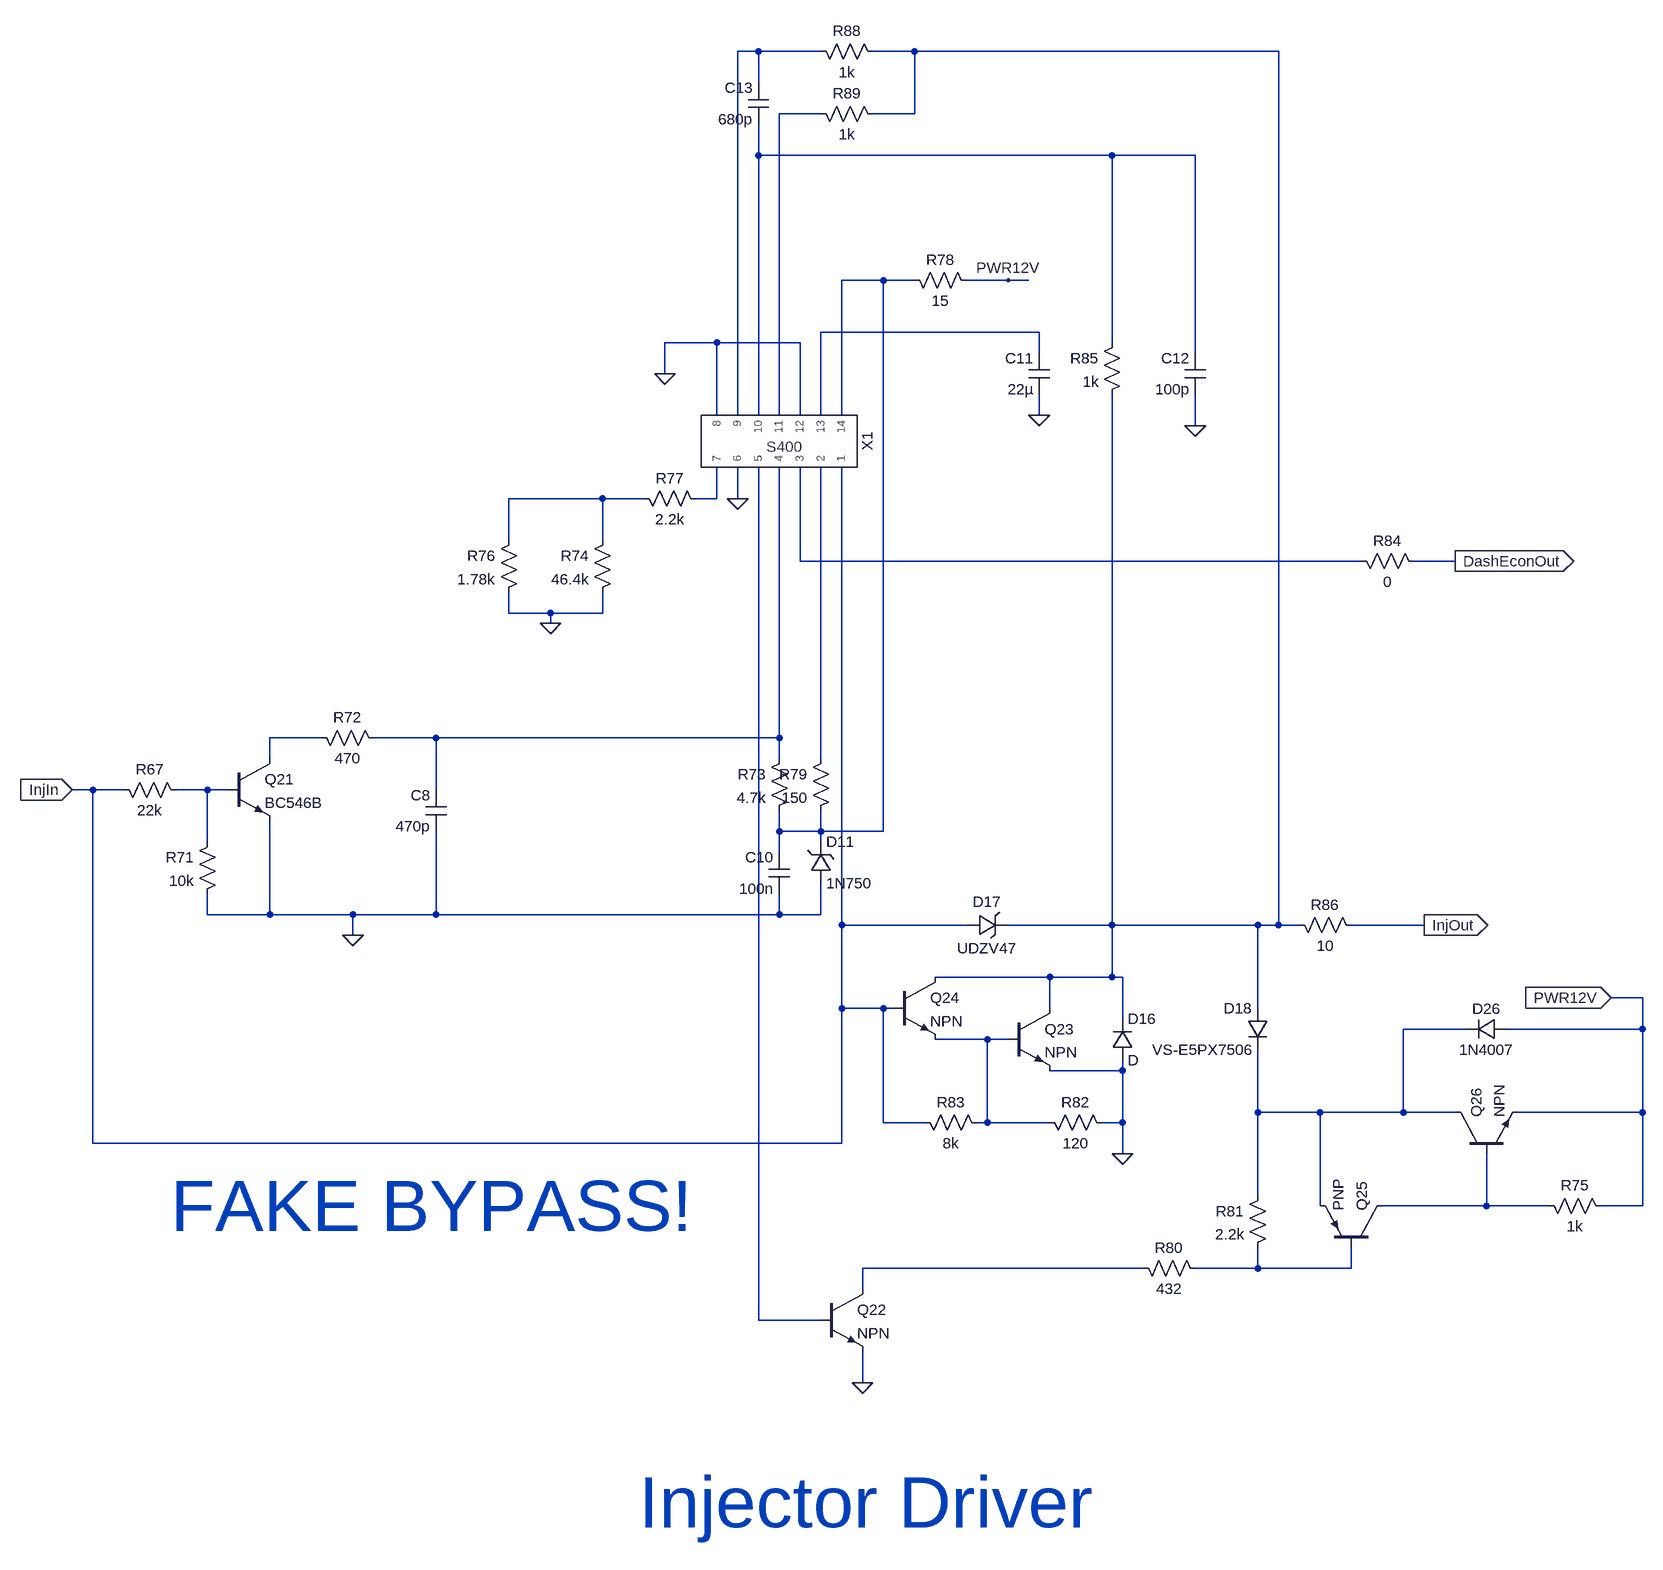
[diagram p0: schematic dme_analog_injector_driver.asc]
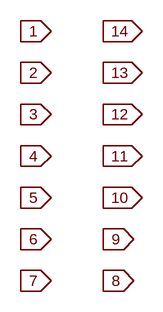
[diagram p1: sub-circuit s400.asc]
dme_analog_injector_driver.asc, the LTspice schematic file:
Version 4
SHEET 1 4356 3824
WIRE -2992 1072 -3024 1072
WIRE -2896 1072 -2992 1072
WIRE -2752 1072 -2816 1072
WIRE -2192 1072 -2752 1072
WIRE -2992 1120 -2992 1072
WIRE -2896 1168 -2960 1168
WIRE -2752 1168 -2752 1072
WIRE -2752 1168 -2816 1168
WIRE -2992 1232 -2992 1184
WIRE -2448 1232 -2992 1232
WIRE -2320 1232 -2448 1232
WIRE -2800 1424 -2864 1424
WIRE -2752 1424 -2800 1424
WIRE -2608 1424 -2672 1424
WIRE -2576 1424 -2608 1424
WIRE -2560 1504 -2896 1504
WIRE -3056 1520 -3136 1520
WIRE -2928 1520 -3056 1520
WIRE -2448 1520 -2448 1232
WIRE -2560 1536 -2560 1504
WIRE -2320 1536 -2320 1232
WIRE -3136 1568 -3136 1520
WIRE -3056 1632 -3056 1520
WIRE -3024 1632 -3024 1072
WIRE -2992 1632 -2992 1232
WIRE -2960 1632 -2960 1168
WIRE -2928 1632 -2928 1520
WIRE -2896 1632 -2896 1504
WIRE -2864 1632 -2864 1424
WIRE -2560 1632 -2560 1600
WIRE -2320 1648 -2320 1600
WIRE -3232 1760 -3376 1760
WIRE -3168 1760 -3232 1760
WIRE -3056 1760 -3056 1712
WIRE -3056 1760 -3088 1760
WIRE -3024 1760 -3024 1712
WIRE -3376 1824 -3376 1760
WIRE -3232 1824 -3232 1760
WIRE -2928 1856 -2928 1712
WIRE -2064 1856 -2928 1856
WIRE -1920 1856 -1984 1856
WIRE -3376 1936 -3376 1904
WIRE -3312 1936 -3376 1936
WIRE -3232 1936 -3232 1904
WIRE -3232 1936 -3312 1936
WIRE -3312 1952 -3312 1936
WIRE -3664 2128 -3744 2128
WIRE -3488 2128 -3584 2128
WIRE -2960 2128 -2960 1712
WIRE -2960 2128 -3488 2128
WIRE -3744 2160 -3744 2128
WIRE -2960 2160 -2960 2128
WIRE -2896 2160 -2896 1712
WIRE -4016 2208 -4048 2208
WIRE -3968 2208 -4016 2208
WIRE -3840 2208 -3888 2208
WIRE -3808 2208 -3840 2208
WIRE -3488 2208 -3488 2128
WIRE -2960 2272 -2960 2240
WIRE -2896 2272 -2896 2240
WIRE -2896 2272 -2960 2272
WIRE -2800 2272 -2800 1424
WIRE -2800 2272 -2896 2272
WIRE -3840 2288 -3840 2208
WIRE -2896 2288 -2896 2272
WIRE -2960 2304 -2960 2272
WIRE -3840 2400 -3840 2368
WIRE -3744 2400 -3744 2256
WIRE -3744 2400 -3840 2400
WIRE -3616 2400 -3744 2400
WIRE -3488 2400 -3488 2272
WIRE -3488 2400 -3616 2400
WIRE -2960 2400 -2960 2368
WIRE -2960 2400 -3488 2400
WIRE -2896 2400 -2896 2352
WIRE -2896 2400 -2960 2400
WIRE -2864 2416 -2864 1712
WIRE -2672 2416 -2864 2416
WIRE -2448 2416 -2448 1600
WIRE -2448 2416 -2608 2416
WIRE -2224 2416 -2448 2416
WIRE -2192 2416 -2192 1072
WIRE -2192 2416 -2224 2416
WIRE -2160 2416 -2192 2416
WIRE -1968 2416 -2080 2416
WIRE -3616 2432 -3616 2400
WIRE -2544 2496 -2720 2496
WIRE -2448 2496 -2448 2416
WIRE -2448 2496 -2544 2496
WIRE -2432 2496 -2448 2496
WIRE -1632 2528 -1680 2528
WIRE -2864 2544 -2864 2416
WIRE -2800 2544 -2864 2544
WIRE -2784 2544 -2800 2544
WIRE -2544 2544 -2544 2496
WIRE -2224 2544 -2224 2416
WIRE -2432 2560 -2432 2496
WIRE -1904 2576 -2000 2576
WIRE -1632 2576 -1632 2528
WIRE -1632 2576 -1840 2576
WIRE -2640 2592 -2720 2592
WIRE -2608 2592 -2640 2592
WIRE -2432 2640 -2432 2624
WIRE -2432 2640 -2544 2640
WIRE -2224 2704 -2224 2608
WIRE -2128 2704 -2224 2704
WIRE -2000 2704 -2000 2576
WIRE -2000 2704 -2128 2704
WIRE -1920 2704 -2000 2704
WIRE -1632 2704 -1632 2576
WIRE -1632 2704 -1824 2704
WIRE -2800 2720 -2800 2544
WIRE -2736 2720 -2800 2720
WIRE -2640 2720 -2640 2592
WIRE -2640 2720 -2656 2720
WIRE -2544 2720 -2640 2720
WIRE -2432 2720 -2432 2640
WIRE -2432 2720 -2464 2720
WIRE -4016 2752 -4016 2208
WIRE -2864 2752 -4016 2752
WIRE -2864 2752 -2864 2544
WIRE -2432 2768 -2432 2720
WIRE -2224 2832 -2224 2704
WIRE -2128 2848 -2128 2704
WIRE -1872 2848 -1872 2768
WIRE -1872 2848 -2032 2848
WIRE -1776 2848 -1872 2848
WIRE -1632 2848 -1632 2704
WIRE -1632 2848 -1696 2848
WIRE -2400 2944 -2832 2944
WIRE -2224 2944 -2224 2912
WIRE -2224 2944 -2320 2944
WIRE -2080 2944 -2080 2912
WIRE -2080 2944 -2224 2944
WIRE -2832 2976 -2832 2944
WIRE -2992 3024 -2992 1712
WIRE -2896 3024 -2992 3024
WIRE -2832 3120 -2832 3072
FLAG -4048 2208 InjIn
IOPIN -4048 2208 In
FLAG -3616 2432 0
FLAG -3024 1760 0
FLAG -3312 1952 0
FLAG -2608 1424 PWR12V
FLAG -2832 3120 0
FLAG -2432 2768 0
FLAG -2560 1632 0
FLAG -3136 1568 0
FLAG -2320 1648 0
FLAG -1920 1856 DashEconOut
IOPIN -1920 1856 Out
FLAG -1968 2416 InjOut
IOPIN -1968 2416 Out
FLAG -1680 2528 PWR12V
IOPIN -1680 2528 In
SYMBOL Res -3984 2192 M90
WINDOW 0 0 56 VBottom 2
WINDOW 3 32 56 VTop 2
SYMATTR InstName R67
SYMATTR Value 22k
SYMBOL Res -3824 2272 M0
SYMATTR InstName R71
SYMATTR Value 10k
SYMBOL Res -3680 2112 M90
WINDOW 0 0 56 VBottom 2
WINDOW 3 32 56 VTop 2
SYMATTR InstName R72
SYMATTR Value 470
SYMBOL Cap -3472 2208 M0
SYMATTR InstName C8
SYMATTR Value 470p
SYMBOL npn -3808 2160 R0
SYMATTR InstName Q21
SYMATTR Value BC546B
SYMBOL Res -2944 2144 M0
SYMATTR InstName R73
SYMATTR Value 4.7k
SYMBOL Cap -2944 2304 M0
SYMATTR InstName C10
SYMATTR Value 100n
SYMBOL Res -3216 1808 M0
SYMATTR InstName R74
SYMATTR Value 46.4k
SYMBOL Res -3360 1808 M0
SYMATTR InstName R76
SYMATTR Value 1.78k
SYMBOL Res -3184 1744 M90
WINDOW 0 0 56 VBottom 2
WINDOW 3 32 56 VTop 2
SYMATTR InstName R77
SYMATTR Value 2.2k
SYMBOL Res -2880 2144 M0
SYMATTR InstName R79
SYMATTR Value 150
SYMBOL zener -2912 2352 M180
WINDOW 0 24 64 Left 2
WINDOW 3 24 0 Left 2
SYMATTR InstName D11
SYMATTR Value 1N750
SYMBOL Res -2768 1408 M90
WINDOW 0 0 56 VBottom 2
WINDOW 3 32 56 VTop 2
SYMATTR InstName R78
SYMATTR Value 15
SYMBOL npn -2896 2976 R0
SYMATTR InstName Q22
SYMBOL Res -2416 2928 M90
WINDOW 0 0 56 VBottom 2
WINDOW 3 32 56 VTop 2
SYMATTR InstName R80
SYMATTR Value 432
SYMBOL Res -2208 2816 M0
SYMATTR InstName R81
SYMATTR Value 2.2k
SYMBOL npn -2608 2544 R0
SYMATTR InstName Q23
SYMBOL npn -2784 2496 R0
SYMATTR InstName Q24
SYMBOL diode -2448 2624 M180
WINDOW 0 24 64 Left 2
WINDOW 3 24 0 Left 2
SYMATTR InstName D16
SYMBOL Res -2560 2704 M90
WINDOW 0 0 56 VBottom 2
WINDOW 3 32 56 VTop 2
SYMATTR InstName R82
SYMATTR Value 120
SYMBOL Res -2640 2736 M270
WINDOW 0 32 56 VTop 2
WINDOW 3 0 56 VBottom 2
SYMATTR InstName R83
SYMATTR Value 8k
SYMBOL Res -2080 1840 M90
WINDOW 0 0 56 VBottom 2
WINDOW 3 32 56 VTop 2
SYMATTR InstName R84
SYMATTR Value 0
SYMBOL Cap -2544 1536 M0
SYMATTR InstName C11
SYMATTR Value 22µ
SYMBOL Res -2432 1504 M0
SYMATTR InstName R85
SYMATTR Value 1k
SYMBOL zener -2672 2400 M90
WINDOW 0 -4 32 VBottom 2
WINDOW 3 36 32 VTop 2
SYMATTR InstName D17
SYMATTR Value UDZV47
SYMBOL Res -2176 2400 M90
WINDOW 0 0 56 VBottom 2
WINDOW 3 32 56 VTop 2
SYMATTR InstName R86
SYMATTR Value 10
SYMBOL Cap -2304 1536 M0
SYMATTR InstName C12
SYMATTR Value 100p
SYMBOL pnp -2032 2912 M270
SYMATTR InstName Q25
SYMBOL npn -1920 2768 R270
SYMATTR InstName Q26
SYMBOL diode -2208 2544 M0
SYMATTR InstName D18
SYMATTR Value VS-E5PX7506
SYMBOL Res -2912 1152 M90
WINDOW 0 0 56 VBottom 2
WINDOW 3 32 56 VTop 2
SYMATTR InstName R89
SYMATTR Value 1k
SYMBOL Res -2912 1056 M90
WINDOW 0 0 56 VBottom 2
WINDOW 3 32 56 VTop 2
SYMATTR InstName R88
SYMATTR Value 1k
SYMBOL Cap -2976 1120 M0
SYMATTR InstName C13
SYMATTR Value 680p
SYMBOL diode -1840 2592 M270
WINDOW 0 32 32 VTop 2
WINDOW 3 0 32 VBottom 2
SYMATTR InstName D26
SYMATTR Value 1N4007
SYMBOL Res -1792 2832 M90
WINDOW 0 0 56 VBottom 2
WINDOW 3 32 56 VTop 2
SYMATTR InstName R75
SYMATTR Value 1k
SYMBOL S400 -2960 1680 M270
SYMATTR InstName X1
TEXT -3176 3304 Left 7 ;Injector Driver
TEXT -3896 2848 Left 7 ;FAKE BYPASS!

s400.asc, the sub-circuit schematic file:
Version 4
SHEET 1 880 704
FLAG 80 208 1
IOPIN 80 208 In
FLAG 80 272 2
IOPIN 80 272 In
FLAG 80 336 3
IOPIN 80 336 In
FLAG 80 400 4
IOPIN 80 400 In
FLAG 80 464 5
IOPIN 80 464 In
FLAG 80 528 6
IOPIN 80 528 In
FLAG 80 592 7
IOPIN 80 592 In
FLAG 160 592 8
IOPIN 160 592 Out
FLAG 160 528 9
IOPIN 160 528 Out
FLAG 160 464 10
IOPIN 160 464 Out
FLAG 160 400 11
IOPIN 160 400 Out
FLAG 160 336 12
IOPIN 160 336 Out
FLAG 160 272 13
IOPIN 160 272 Out
FLAG 160 208 14
IOPIN 160 208 Out

The netlist it stands for:
* dme_analog_injector_driver.asc
R67 InjIn N013 22k
R71 N013 0 10k
R72 N010 N011 470
C8 N011 0 470p
Q21 N010 N013 0 0 BC546B
R73 N011 N005 4.7k
C10 N005 0 100n
R74 N007 0 46.4k
R76 N007 0 1.78k
R77 N007 N008 2.2k
R79 N012 N005 150
D11 0 N005 1N750
R78 N005 PWR12V 15
Q22 N017 N019 0 0 NPN
R80 N017 N018 432
R81 N014 N018 2.2k
Q23 N002 N015 0 0 NPN
Q24 N002 InjIn N015 0 NPN
D16 0 N002 D
R82 N015 0 120
R83 N015 InjIn 8k
R84 N009 DashEconOut 0
C11 N006 0 22µ
R85 N004 N002 1k
D17 InjIn N002 UDZV47
R86 N002 InjOut 10
C12 N004 0 100p
Q25 N016 N018 N014 0 PNP
Q26 N014 N016 PWR12V 0 NPN
D18 N002 N014 VS-E5PX7506
R89 N003 N002 1k
R88 N001 N002 1k
C13 N001 N004 680p
D26 PWR12V N014 1N4007
R75 N016 PWR12V 1k
XX1 InjIn N012 N009 N011 N019 0 N008 N005 N006 0 N003 N004 N001 0 s400

* block symbol definitions
.subckt s400 1 2 3 4 5 6 7 14 13 12 11 10 9 8
.ends s400

.model D D
.lib standard.dio
.model NPN NPN
.model PNP PNP
.lib standard.bjt
* Injector Driver
* FAKE BYPASS!
.backanno
.end